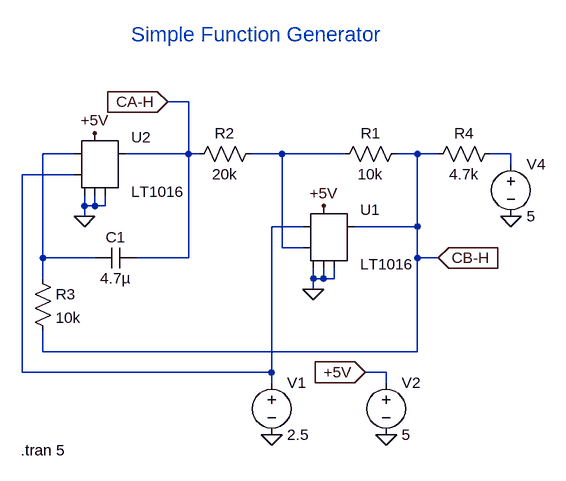
[diagram p0: schematic simple_function_gen_ltspice.asc]
simple_function_gen_ltspice.asc, the LTspice schematic file:
Version 4
SHEET 1 880 756
WIRE -96 192 -128 192
WIRE -272 272 -320 272
WIRE -96 272 -96 192
WIRE -96 272 -192 272
WIRE -80 272 -96 272
WIRE 48 272 0 272
WIRE 144 272 48 272
WIRE 256 272 224 272
WIRE 288 272 256 272
WIRE 400 272 368 272
WIRE 400 288 400 272
WIRE -272 304 -352 304
WIRE -256 352 -256 336
WIRE -240 352 -240 336
WIRE -240 352 -256 352
WIRE -224 352 -224 336
WIRE -224 352 -240 352
WIRE -256 368 -256 352
WIRE 80 384 32 384
WIRE 256 384 256 272
WIRE 256 384 160 384
WIRE 48 416 48 272
WIRE 80 416 48 416
WIRE -320 432 -320 272
WIRE -240 432 -320 432
WIRE -96 432 -96 272
WIRE -96 432 -176 432
WIRE 256 432 256 384
WIRE 288 432 256 432
WIRE -320 464 -320 432
WIRE 96 464 96 448
WIRE 112 464 112 448
WIRE 112 464 96 464
WIRE 128 464 128 448
WIRE 128 464 112 464
WIRE 96 480 96 464
WIRE -320 576 -320 544
WIRE 256 576 256 432
WIRE 256 576 -320 576
WIRE -352 608 -352 304
WIRE 32 608 32 384
WIRE 32 608 -352 608
WIRE 208 608 176 608
WIRE 32 624 32 608
WIRE 208 624 208 608
FLAG 96 480 0
FLAG -256 368 0
FLAG -240 240 +5V
FLAG 112 352 +5V
FLAG 32 704 0
FLAG -128 192 CA-H
IOPIN -128 192 In
FLAG 208 704 0
FLAG 176 608 +5V
IOPIN 176 608 In
FLAG 400 368 0
FLAG 288 432 CB-H
IOPIN 288 432 In
SYMBOL Comparators\\LT1016 112 336 R0
SYMATTR InstName U1
SYMBOL Comparators\\LT1016 -240 224 R0
SYMATTR InstName U2
SYMBOL cap -176 416 R90
WINDOW 0 0 32 VBottom 2
WINDOW 3 32 32 VTop 2
SYMATTR InstName C1
SYMATTR Value 4.7µ
SYMBOL res -336 448 R0
SYMATTR InstName R3
SYMATTR Value 10k
SYMBOL res 16 256 R90
WINDOW 0 0 56 VBottom 2
WINDOW 3 32 56 VTop 2
SYMATTR InstName R2
SYMATTR Value 20k
SYMBOL res 240 256 R90
WINDOW 0 0 56 VBottom 2
WINDOW 3 32 56 VTop 2
SYMATTR InstName R1
SYMATTR Value 10k
SYMBOL res 384 256 R90
WINDOW 0 0 56 VBottom 2
WINDOW 3 32 56 VTop 2
SYMATTR InstName R4
SYMATTR Value 4.7k
SYMBOL voltage 32 608 R0
SYMATTR InstName V1
SYMATTR Value 2.5
SYMBOL voltage 208 608 R0
SYMATTR InstName V2
SYMATTR Value 5
SYMBOL voltage 400 272 R0
SYMATTR InstName V4
SYMATTR Value 5
TEXT -184 88 Left 3 ;Simple Function Generator
TEXT -354 728 Left 2 !.tran 5

The netlist it stands for:
* simple_function_gen_ltspice.asc
XU1 +5V N002 N004 0 0 0 CB-H NC_01 LT1016
XU2 +5V N004 N001 0 0 0 CA-H NC_02 LT1016
C1 CA-H N001 4.7µ
R3 N001 CB-H 10k
R2 N002 CA-H 20k
R1 CB-H N002 10k
R4 N003 CB-H 4.7k
V1 N004 0 2.5
V2 +5V 0 5
V4 N003 0 5
* Simple Function Generator
.tran 5
.lib LTC.lib
.backanno
.end